# EAGLE design microcontroller-esp32 (EAGLE 9.6.2)
DATE: 22-04-2019; REV: V1 P3; TITLE: TinyPICO
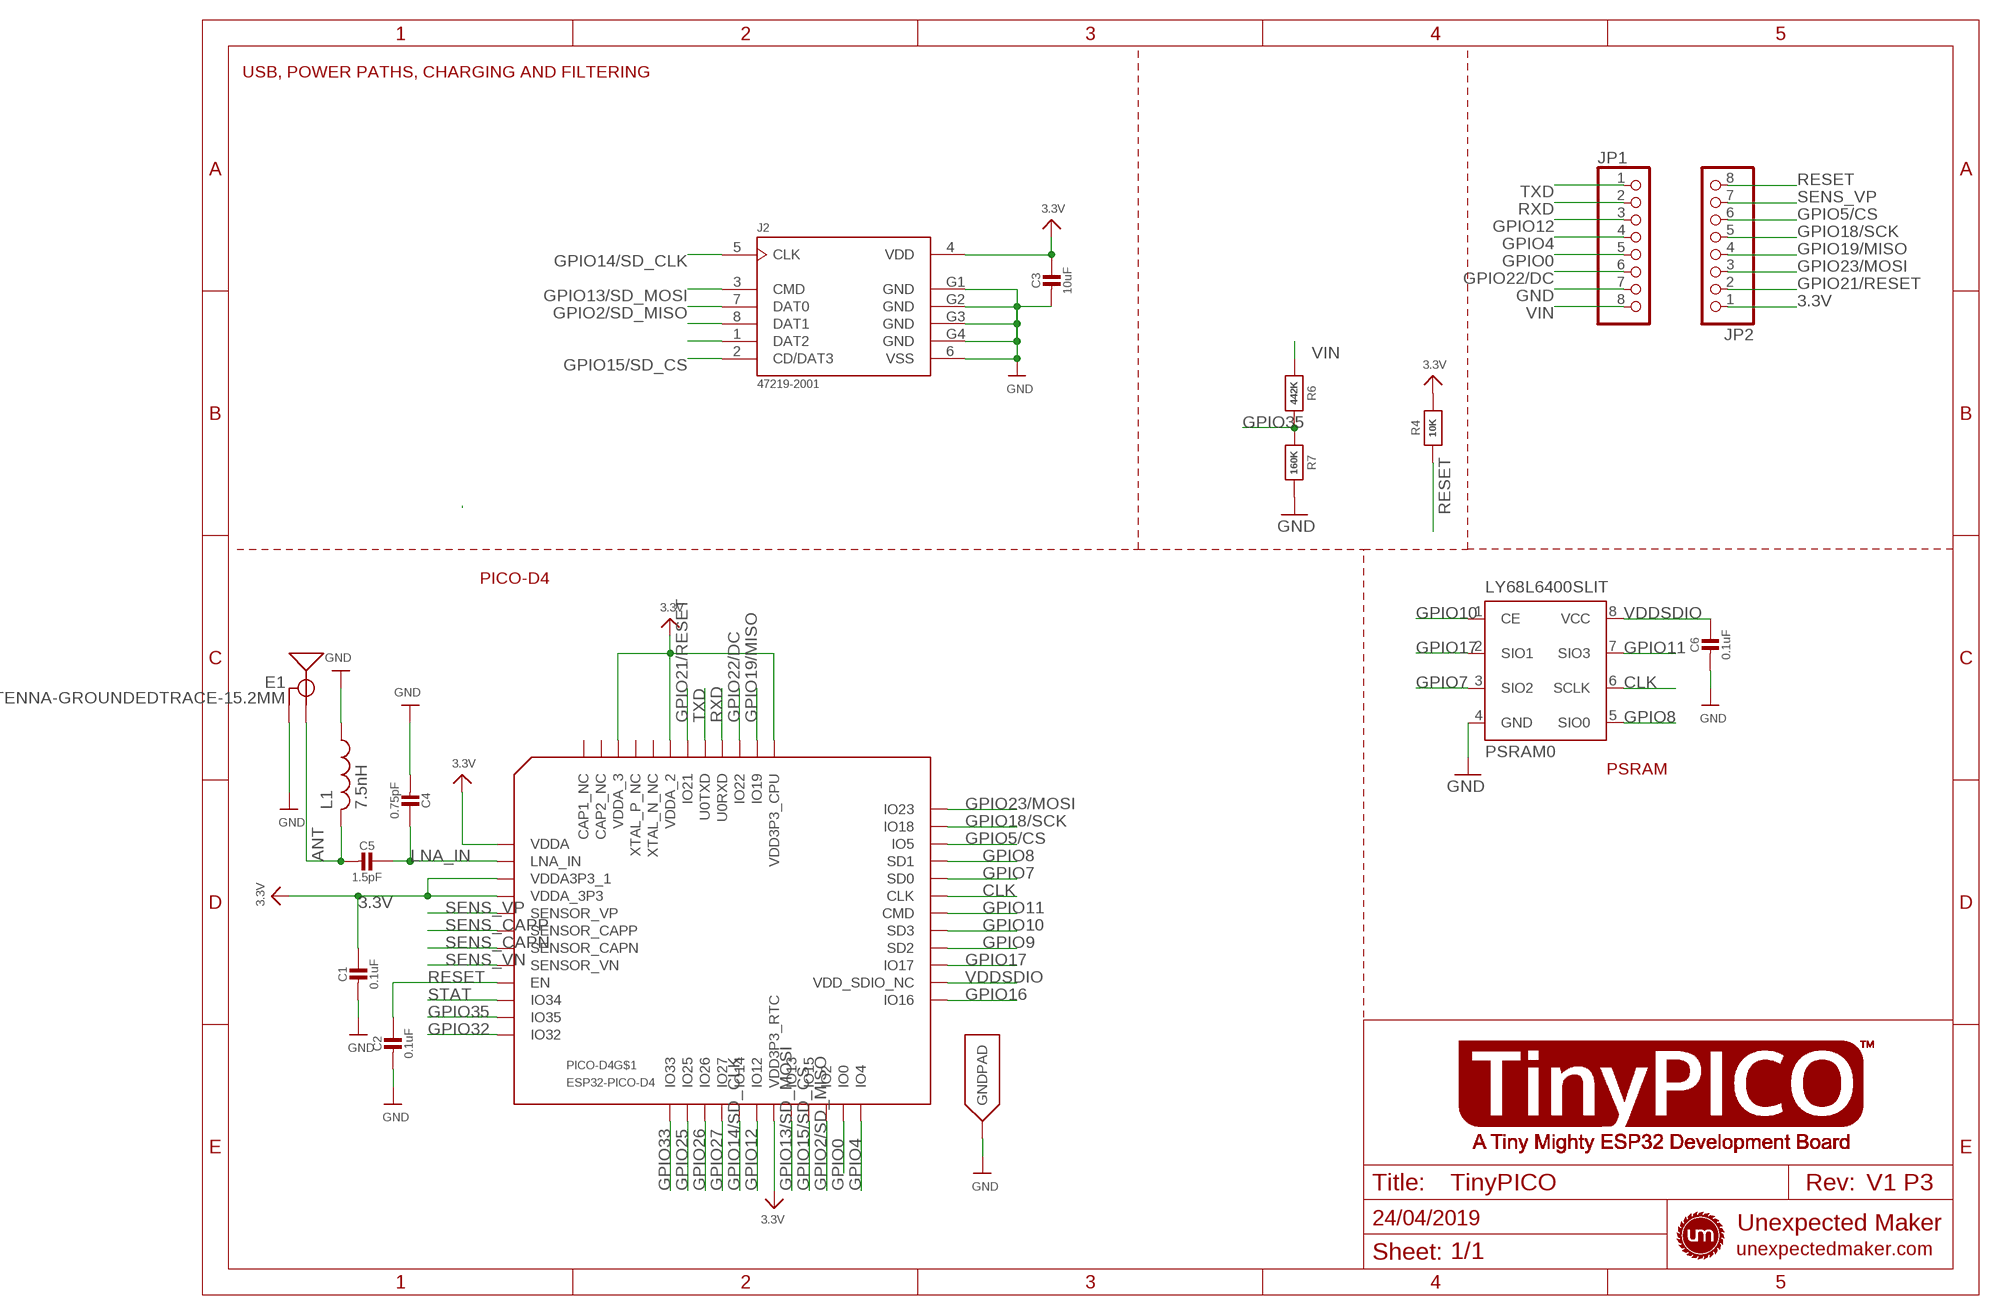
[diagram p0: schematic, sheet 1]
FRAME2 (FRAME_A4_TINYPICO): CDATE: 24/04/2019; REV: V1 P3; SHEET_NUM: 1/1; TITLE: TinyPICO

## Parts
C1  0.1uF  CAP_CERAMIC_0402MP  [_0402MP]
C2  0.1uF  CAP_CERAMIC_0402MP  [_0402MP]
C3  10uF  CAP_CERAMIC_0402MP  [_0402MP]
C4  0.75pF  CAP_CERAMIC_0402MP  [_0402MP]
C5  1.5pF  CAP_CERAMIC_0402MP  [_0402MP]
C6  0.1uF  CAP_CERAMIC_0402MP  [_0402MP]
E1  ANTENNA-GROUNDEDTRACE-15.2MM  [TRACE_ANTENNA_2.4GHZ_15.2MM]
J2  47219-2001  [MOLEX_47219-2001]
JP1  PINHD-1X8CLEANBIG  [1X08-CLEANBIG]
JP2  PINHD-1X8CLEANBIG  [1X08-CLEANBIG]
L1  7.5nH  INDUCTOR_0402_N  [RESC0402_N]
LY68L6400SLIT  PSRAM0  [SOP8]
PICO-D4  ESP32-PICO-D4  [PICO-D4-QFN48]
R4  10K  RESISTOR_0402MP  [_0402MP]
R6  442K  RESISTOR_0402MP  [_0402MP]
R7  160K  RESISTOR_0402MP  [_0402MP]

## Nets
3.3V: C1.1 C3.1 J2.4(VDD) JP2.1 PICO-D4.1(VDDA) PICO-D4.3(VDDA3P3_1) PICO-D4.4(VDDA_3P3) PICO-D4.19(VDD3P3_RTC) PICO-D4.37(VDD3P3_CPU) PICO-D4.43(VDDA_2) PICO-D4.46(VDDA_3) R4.2
ANT: C5.2 E1.ANT(SIGNAL) L1.2
CLK: LY68L6400SLIT.6(SCLK) PICO-D4.31(CLK)
GND: C1.2 C2.2 C3.2 C4.2 C6.2 E1.GND J2.6(VSS) J2.G1(GND) J2.G2(GND) J2.G3(GND) J2.G4(GND) JP1.7 L1.1 LY68L6400SLIT.4(GND) PICO-D4.EXP(GNDPAD) R7.2
GPIO0: JP1.5 PICO-D4.23(IO0)
GPIO2/SD_MISO: J2.7(DAT0) PICO-D4.22(IO2)
GPIO4: JP1.4 PICO-D4.24(IO4)
GPIO5/CS: JP2.6 PICO-D4.34(IO5)
GPIO7: LY68L6400SLIT.3(SIO2) PICO-D4.32(SD0)
GPIO8: LY68L6400SLIT.5(SIO0) PICO-D4.33(SD1)
GPIO9: PICO-D4.28(SD2)
GPIO10: LY68L6400SLIT.1(CE) PICO-D4.29(SD3)
GPIO11: LY68L6400SLIT.7(SIO3) PICO-D4.30(CMD)
GPIO12: JP1.3 PICO-D4.18(IO12)
GPIO13/SD_MOSI: J2.3(CMD) PICO-D4.20(IO13)
GPIO14/SD_CLK: J2.5(CLK) PICO-D4.17(IO14)
GPIO15/SD_CS: J2.2(CD/DAT3) PICO-D4.21(IO15)
GPIO16: PICO-D4.25(IO16)
GPIO17: LY68L6400SLIT.2(SIO1) PICO-D4.27(IO17)
GPIO18/SCK: JP2.5 PICO-D4.35(IO18)
GPIO19/MISO: JP2.4 PICO-D4.38(IO19)
GPIO21/RESET: JP2.2 PICO-D4.42(IO21)
GPIO22/DC: JP1.6 PICO-D4.39(IO22)
GPIO23/MOSI: JP2.3 PICO-D4.36(IO23)
GPIO25: PICO-D4.14(IO25)
GPIO26: PICO-D4.15(IO26)
GPIO27: PICO-D4.16(IO27)
GPIO32: PICO-D4.12(IO32)
GPIO33: PICO-D4.13(IO33)
GPIO35: PICO-D4.11(IO35) R6.2 R7.1
LNA_IN: C4.1 C5.1 PICO-D4.2(LNA_IN)
N$4: J2.8(DAT1)
N$5: J2.1(DAT2)
RESET: C2.1 JP2.8 PICO-D4.9(EN) R4.1
RXD: JP1.2 PICO-D4.40(U0RXD)
SENS_CAPN: PICO-D4.7(SENSOR_CAPN)
SENS_CAPP: PICO-D4.6(SENSOR_CAPP)
SENS_VN: PICO-D4.8(SENSOR_VN)
SENS_VP: JP2.7 PICO-D4.5(SENSOR_VP)
STAT: PICO-D4.10(IO34)
TXD: JP1.1 PICO-D4.41(U0TXD)
VDDSDIO: C6.1 LY68L6400SLIT.8(VCC) PICO-D4.26(VDD_SDIO_NC)
VIN [power]: JP1.8 R6.1
Unconnected: PICO-D4.44(XTAL_N_NC) PICO-D4.45(XTAL_P_NC) PICO-D4.47(CAP2_NC) PICO-D4.48(CAP1_NC)

## Notes on the sheet
- USB, POWER PATHS, CHARGING AND FILTERING
- PICO-D4
- PSRAM

## Library data of the parts
C1-C6 = microbuilder:CAP_CERAMIC: Ceramic Capacitors For new designs, use the packages preceded by an '_' character since they are more reliable: The following footprints should be used on most boards: _0402 - Standard footprint for regular board layouts _0603 - Standard footprint for regular board layouts _0805 - Standard footprint for regular board layouts _1206 - Standard footprint for regular board layouts For extremely tight-pitch boards where space is at a premium, the following 'micro-pitch' footprints can be used (smaller pads, no silkscreen outline, etc.): _0402MP - Micro-pitch footprint for very dense/compact boards _0603MP - Micro-pitch footprint for very dense/compact boards _0805MP - Micro-pitch footprint for very dense/compact boards _1206MP - Micro-pitch footprint for very dense/compact boards
E1 = SparkFun-RF:ANTENNA-GROUNDED: Antenna w/ Ground Connection 2.4GHz antennae with signal and ground terminals. TRACE_ANTENNA_2.4GHZ_15.2MM - Meander Trace antenna 15.2 x 5.7mm footprint Based on layout from TI app note AN043 <http://www.ti.com/lit/an/swra117d/swra117d.pdf>. TRACE_ANTENNA_2.4GHZ_25.7MM - Inverted F trace antenna 25.7 x 7.5 mm footprint. Based on layout from TI design note DN0007 <http://www.ti.com/lit/an/swru120b/swru120b.pdf>.
J2 = 47219-2001:47219-2001: 1.10mm Pitch microSD Card Connector, Hinge Type, Lead-Free http://www.snapeda.com/parts/47219-2001/Molex%20/%20Waldom/view-part/# Check prices <https://pricing.snapeda.com/parts/47219-2001/Molex/view-part?ref=eda>; AVAILABILITY: In Stock; DESCRIPTION: 8 Position Card Connector Secure Digital - microSD™ Surface Mount, Right Angle Gold; MF: Molex; MP: 47219-2001; PACKAGE: None; PRICE: None; PURCHASE-URL: https://pricing.snapeda.com/search/part/47219-2001/?ref=eda
JP1 JP2 = adafruit:PINHD-1X8: PIN HEADER; BOTTOM: 1; MPN: 83-15410; THRU-HOLE: 1
L1 = Nordic_nRF:INDUCTOR: Generic chip inductor
LY68L6400SLIT = UnexpectedMaker:PSRAM: H-bridge driver for brush motors Source: http://www.rohm.com/products/databook/motor/pdf/bd623x_series-e.pdf; MPN: BD6230F-E2; OC_FARNELL: 1716264; OC_NEWARK: 15R0529
PICO-D4 = UnexpectedMaker:ESP32-PICO-D4
R4 R6 R7 = microbuilder:RESISTOR: Resistors 0402 - 0402 Surface Mount Package 22 Ohm 1% 1/16W [Digikey: 311-22.0LRTR-ND] 33 Ohm 5% 1/16W 1.0K 5% 1/16W 1.5K 5% 1/16W 2.0K 1% 1/16W 10.0K 1% 1/16W [Digikey: 311-10.0KLRTR-ND] 10.0K 5% 1/16W [Digikey: RMCF0402JT10K0TR-ND] 12.1K 1% 1/16W [Digikey: 311-22.0LRTR-ND] 100.0K 5% 1/16W 0603 - 0603 Surface Mount Package 0 Ohm 1/10 Watt 1% Resistor 15 Ohm 1/10 Watt 1% Resistor 33 Ohm 1/10 Watt 1% Resistor 49.9 Ohm 1/10 Watt 1% Resistor 100 Ohm 1/10 Watt 1% Resistor 150 Ohm 1/10 Watt 1% Resistor 240 Ohm 1/10 Watt 1% Resistor 390 Ohm 1/10 Watt 1% Resistor 560 Ohm 1/10 Watt 1% Resistor 680 Ohm 1/10 Watt 1% Resistor 750 Ohm 1/10 Watt 1% Resistor 1.0K Ohm 1/10 Watt 1% Resistor 1.5K Ohm 1/10 Watt 1% Resistor 2.0K Ohm 1/10 Watt 1% Resistor 2.2K Ohm 1/10 Watt 1% Resistor 3.3K Ohm 1/10 Watt 1% Resistor 4.7K Ohm 1/10 Watt 1% Resistor 10.0K Ohm 1/10 Watt 1% Resistor 12.0K Ohm 1/10 Watt 1% Resistor 12.1K Ohm 1/10 Watt 1% Resistor 20.0K Ohm 1/10 Watt 1% Resistor 33.0K Ohm 1/10 Watt 1% Resistor 100.0K Ohm 1/10 Watt 1% Resistor 0805 - 0805 Surface Mount Package 0 Ohm 1/8 Watt 1% Resistor 33 Ohm 1/8 Watt 1% Resistor 100 Ohm 1/8 Watt 1% Resistor 150 Ohm 1/8 Watt 1% Resistor 200 Ohm 1/8 Watt 1% Resistor 240 Ohm 1/8 Watt 1% Resistor 330 Ohm 1/8 Watt 1% Resistor 390 Ohm 1/8 Watt 1% Resistor 470 Ohm 1/8 Watt 1% Resistor 1.0K Ohm 1/8 Watt 1% Resistor 1.5K Ohm 1/8 Watt 1% Resistor 2.0K Ohm 1/8 Watt 1% Resistor 4.7K Ohm 1/8 Watt 1% Resistor 5.1K Ohm 1/8 Watt 1% Resistor 5.6K Ohm 1/8 Watt 1% Resistor 10.0K Ohm 1/8 Watt 1% Resistor 22.0K Ohm 1/8 Watt 1% Resistor 33.0K Ohm 1/8 Watt 1% Resistor 100K Ohm 1/8 Watt 1% Resistor 1206 - 1206 Surface Mount Package 2012 - 2010 Surface Mount Package 0.11 Ohm 1/2 Watt 1% Resistor - Digikey: RHM.11UCT-ND

## Net classes
1 power: width 0.406 mm

## Board
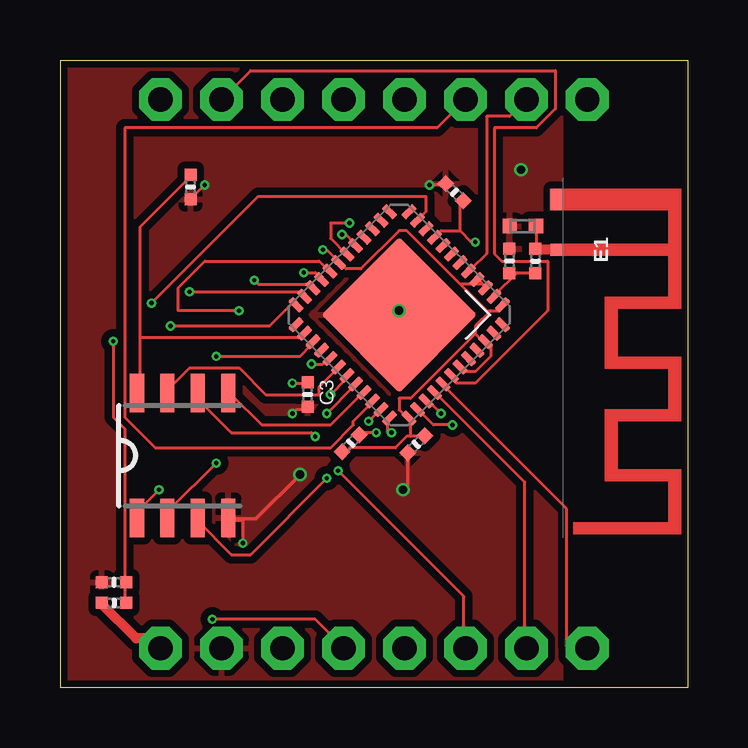
[diagram p1: board, top side]
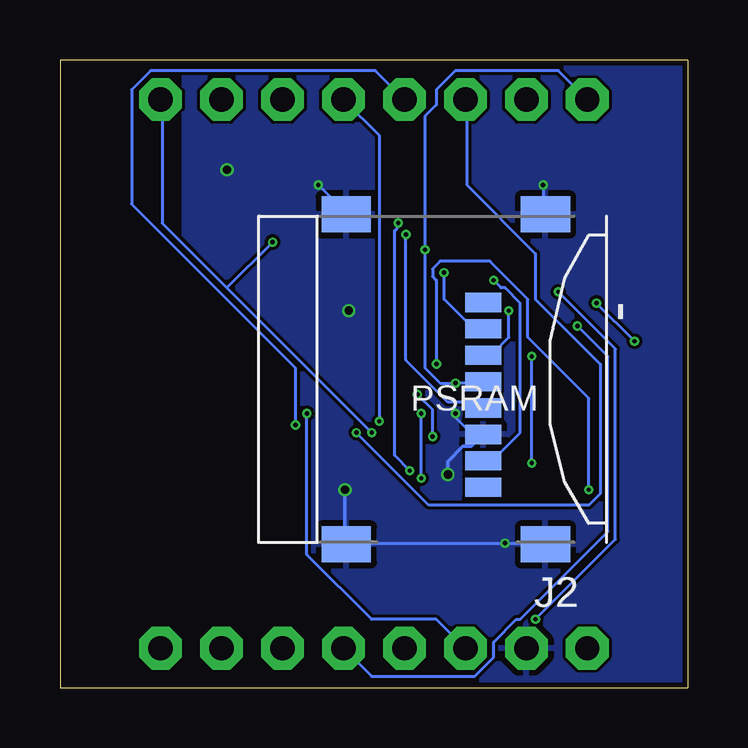
[diagram p2: board, bottom side, seen from below]

Size 26.16 x 26.16 mm. Coordinates in mm from the lower left corner, seen from the top.
Outline: 26.16,0 0,0 0,26.16 26.16,26.16 26.16,0
Copper layers (1+2*15+16): Top 0.035mm / dielectric 0.18mm / GND 0.017mm / dielectric 1.12mm / 3.3V 0.017mm / dielectric 0.18mm / Bottom 0.035mm
Design rules "UnexpectedMaker_JLCPCB 4 Layer Tight": minimum track width 5mil, minimum drill 7mil, track to track 5mil, track to pad 5mil, pad to pad 5mil, via to via 5mil, smd to smd 5mil, copper to edge 9mil, drill to drill 6mil, minimum pad ring 4mil, minimum via ring 4mil, stop-mask expansion 1.25mil, vias tented up to drill 12mil, thermal gap 10mil

### Footprints (pad centres in the part's own frame; a part is rotated, then mirrored left to right if it is on the bottom)
_0402MP = smd 0.5 x 0.5: 1 -0.508,0; 2 0.508,0
TRACE_ANTENNA_2.4GHZ_15.2MM = smd 0.5 x 0.5: ANT 0,-0.25 | smd 0.9 x 0.5: GND -2.1,-0.25
MOLEX_47219-2001 = smd 0.8 x 1.5: 1 3.2,-2.1; 2 2.1,-2.1; 3 1,-2.1; 4 -0.1,-2.1; 5 -1.2,-2.1; 6 -2.3,-2.1; 7 -3.4,-2.1; 8 -4.5,-2.1 | smd 1.5 x 2.05: G1 6.875,-4.7; G2 6.875,3.6; G3 -6.875,3.6; G4 -6.875,-4.7
1X08-CLEANBIG = drill 1.016 pad 1.778 octagon: 1 -8.89,0; 2 -6.35,0; 3 -3.81,0; 4 -1.27,0; 5 1.27,0; 6 3.81,0; 7 6.35,0; 8 8.89,0
RESC0402_N = smd 0.6 x 0.6: 1 -0.55,0; 2 0.55,0
SOP8 = smd 0.6 x 1.6: 1 -1.905,-2.6; 2 -0.635,-2.6; 3 0.635,-2.6; 4 1.905,-2.6; 5 1.905,2.6; 6 0.635,2.6; 7 -0.635,2.6; 8 -1.905,2.6
PICO-D4-QFN48 = smd 0.66 x 0.3: 1 -3.327,2.75; 2 -3.327,2.25; 3 -3.327,1.75; 4 -3.327,1.25; 5 -3.327,0.75; 6 -3.327,0.25; 7 -3.327,-0.25; 8 -3.327,-0.75; 9 -3.327,-1.25; 10 -3.327,-1.75; 11 -3.327,-2.25; 12 -3.327,-2.75; 25 3.327,-2.75; 26 3.327,-2.25; 27 3.327,-1.75; 28 3.327,-1.25; 29 3.327,-0.75; 30 3.327,-0.25; 31 3.327,0.25; 32 3.327,0.75; 33 3.327,1.25; 34 3.327,1.75; 35 3.327,2.25; 36 3.327,2.75 | smd 0.3 x 0.66: 13 -2.75,-3.327; 14 -2.25,-3.327; 15 -1.75,-3.327; 16 -1.25,-3.327; 17 -0.75,-3.327; 18 -0.25,-3.327; 19 0.25,-3.327; 20 0.75,-3.327; 21 1.25,-3.327; 22 1.75,-3.327; 23 2.25,-3.327; 24 2.75,-3.327; 37 2.75,3.327; 38 2.25,3.327; 39 1.75,3.327; 40 1.25,3.327; 41 0.75,3.327; 42 0.25,3.327; 43 -0.25,3.327; 44 -0.75,3.327; 45 -1.25,3.327; 46 -1.75,3.327; 47 -2.25,3.327; 48 -2.75,3.327 | smd 4.572 x 4.572: EXP 0,0

### Placement (x,y rotation side)
C1  14.85,10.15 225 top
C2  16.44,20.66 135 top
C3  10.32,12.22 270 top
C4  18.73,17.79 90 top
C5  19.81,17.79 90 top
C6  5.44,20.87 270 top
E1  20.95,18.26 270 top
J2  10.64,12.86 90 bottom
JP1  13.08,1.65 180 top
JP2  13.08,24.51 0 top
L1  19.29,19.24 0 top
LY68L6400SLIT  5.11,9.68 0 top
PICO-D4  14.14,15.54 225 top
R4  12.11,10.19 225 top
R6  2.25,3.54 0 top
R7  2.25,4.4 180 top

### Tracks (layer width: path | path; a pad name or v marks a point on that pad's centre or on a via)
3.3V  (via drill 0.18)
  Top 0.127: 14.61,10.48 15.08,10.48 C1.1 | 14.61,10.48 14.45,10.48 13.97,10 12.06,10 11.91,9.84 R4.2 | 14.61,10.48 14.61,11.11 PICO-D4.37 14.45,11.27 14.13,11.59 14.13,12.06 14.61,12.06 17.3,14.76 | PICO-D4.43 16.67,13.34 16.83,13.18 17.3,13.18 17.94,13.81 17.94,14.29 17.78,14.29 PICO-D4.46 17.62,14.45 17.3,14.76 | 17.62,16.83 17.78,16.67 PICO-D4.3 | 17.62,16.83 17.46,16.99 PICO-D4.4 | 16.67,16.83 14.45,19.05 14.13,19.05 12.54,17.46 11.91,17.46 11.75,17.62 PICO-D4.19 11.59,17.78 11.11,18.26 v10.95,18.26 | 17.62,16.83 16.67,16.83 | 17.94,15.72 17.78,15.72 16.67,16.83 | 17.94,15.72 18.26,15.72 18.41,15.88 PICO-D4.1 | 17.3,14.76 17.3,15.08 17.94,15.72 | v9.68,12.7 10.32,12.7 C3.1
  Bottom 0.127: J2.4 8.57,12.7 v9.68,12.7 10.32,12.7 10.95,13.34 v10.95,18.26 10.95,23.81 10.48,24.29 10.48,24.92 9.68,25.72 5.4,25.72 JP2.1
ANT
  Top 0.127: C5.2 19.84,18.41 19.84,19.21 L1.2
  Top 0.406: E1.ANT 19.85,18.26 C5.2
CLK  (via drill 0.18)
  Top 0.127: v11.27,12.22 11.91,12.86 PICO-D4.31 | v10.64,10.48 10.48,10.64 7.14,10.64 5.87,11.91 5.87,12.22 LY68L6400SLIT.6
  Bottom 0.127: v11.27,12.22 10.64,11.59 v10.64,10.48
GND  (via drill 0.18, 0.35)
  Top 0.127: v9.68,11.43 9.84,11.59 10.32,11.59 C3.2 | 18.73,18.41 C4.2 | v6.03,20.95 5.56,20.48 C6.2 | v15.4,20.95 16.03,20.95 C2.2 | v7.62,6.03 7.62,6.99 7.14,6.99 7.07,7.04 LY68L6400SLIT.4
  Top 0.152: C1.2 14.49,8.46 v14.29,8.26 | v10,8.89 8.15,7.04 7.07,7.04
  Bottom 0.127: J2.G4 6.03,6.03 v7.62,6.03 14.13,6.03 J2.G3 | v9.68,11.43 9.68,11.27 9.05,10.64 8.57,10.64 J2.6 | v6.03,20.95 6.03,19.84 J2.G1 | v15.4,20.95 14.29,19.84 J2.G2
  Bottom 0.152: v14.29,8.26 14.29,6.04 J2.G3 | J2.6 9.03,10.06 9.37,10.06 10,9.43 v10,8.89
  other vias: 14.13,15.72 19.21,21.59
  pour Bottom: -0.32,26.51 -0.32,-0.48 20.95,-0.48 20.95,26.51
  pour Top (isolate 0.305): -0.36,26.34 -0.36,-0.49 20.9,-0.49 20.9,26.34
GPIO0  (via drill 0.18)
  Top 0.127: v5.4,16.51 10,16.51 10.16,16.35 PICO-D4.23 | v6.35,2.86 10.64,2.86 11.75,1.75 JP1.5
  Bottom 0.127: v5.4,16.51 3.02,14.13 3.02,6.19 v6.35,2.86
GPIO2/SD_MISO  (via drill 0.18)
  Top 0.127: v8.1,16.99 8.26,16.83 10.32,16.83 10.48,16.67 PICO-D4.22
  Bottom 0.127: v8.1,16.99 7.78,16.67 7.62,16.67 6.99,16.03 6.99,10.64 8.1,9.53 8.41,9.53 J2.7
GPIO4  (via drill 0.18)
  Top 0.127: v4.6,15.08 8.73,15.08 9.68,16.03 PICO-D4.24
  Bottom 0.127: v4.6,15.08 3.33,13.81 3.33,6.51 6.99,2.86 7.14,2.86 8.1,1.91 8.1,1.27 8.89,0.48 13.18,0.48 JP1.4
GPIO5/CS
  Top 0.127: JP2.6 15.72,23.34 2.7,23.34 2.7,11.27 3.97,10 11.27,10 12.22,10.95 12.22,11.11 13.02,11.91 PICO-D4.34
GPIO7  (via drill 0.18)
  Top 0.127: v11.11,11.43 12.22,12.54 PICO-D4.32 | v11.11,8.73 7.94,5.56 7.14,5.56 5.71,6.99 LY68L6400SLIT.3
  Bottom 0.127: v11.11,8.73 v11.11,11.43
GPIO8
  Top 0.127: PICO-D4.33 12.54,12.22 11.27,10.95 8.41,10.95 7.14,12.22 LY68L6400SLIT.5
GPIO10  (via drill 0.18)
  Top 0.127: v10.48,13.49 10.95,13.49 11.11,13.65 PICO-D4.29 | v4.13,8.26 3.33,7.46 3.33,7.14 LY68L6400SLIT.1
  Bottom 0.127: v10.48,13.49 10.48,16.99 10.64,17.14 10.64,17.46 10.32,17.78 8.26,17.78 6.67,16.19 6.67,14.61 4.13,12.06 v4.13,8.26
GPIO11
  Top 0.127: PICO-D4.30 11.59,13.34 10.79,12.54 10.79,12.22 8.57,12.22 7.46,13.34 5.4,13.34 4.45,12.38 LY68L6400SLIT.7
GPIO12  (via drill 0.18)
  Top 0.127: v12.06,19.37 11.27,19.37 11.27,18.73 11.91,18.1 PICO-D4.18 | v11.59,9.05 16.83,3.81 16.83,1.75 JP1.3
  Bottom 0.127: v12.06,19.37 12.06,19.21 12.22,19.05 12.22,9.68 v11.59,9.05
GPIO13/SD_MOSI  (via drill 0.18)
  Top 0.127: v7.46,15.72 4.92,15.72 4.92,16.67 6.03,17.78 10.79,17.78 11.11,17.46 PICO-D4.20
  Bottom 0.127: v7.46,15.72 7.46,14.61 8.1,13.97 8.41,13.97 J2.3
GPIO14/SD_CLK  (via drill 0.18)
  Top 0.127: v11.75,18.89 11.91,18.89 12.22,18.57 PICO-D4.17
  Bottom 0.127: v11.75,18.89 11.75,13.65 10,11.91 8.73,11.91 8.57,11.75 J2.5
GPIO15/SD_CS  (via drill 0.18)
  Top 0.127: v10.16,17.3 10.64,17.3 10.79,17.14 PICO-D4.21
  Bottom 0.127: v10.16,17.3 10.16,16.19 9.05,15.08 8.57,15.08 J2.2
GPIO17  (via drill 0.18)
  Top 0.127: v6.51,13.81 10,13.81 10.48,14.29 PICO-D4.27 | v6.51,9.37 4.6,7.46 4.6,7.14 LY68L6400SLIT.2
  Bottom 0.127: v6.51,9.37 v6.51,13.81
GPIO18/SCK  (via drill 0.18)
  Top 0.127: v12.86,11.11 13.34,11.59 PICO-D4.35
  Bottom 0.127: v12.86,11.11 12.86,23.02 JP2.5
GPIO19/MISO  (via drill 0.18)
  Top 0.127: v16.35,10.95 15.56,10.95 14.92,11.59 PICO-D4.38
  Bottom 0.127: v16.35,10.95 16.35,13.34 23.18,20.16 23.18,24.92 22.38,25.72 13.02,25.72 JP2.4
GPIO21/RESET
  Top 0.127: JP2.2 7.94,25.72 20.64,25.72 20.64,24.13 19.84,23.34 18.1,23.34 18.1,18.1 18.41,17.78 20.32,17.78 20.32,15.72 17.3,12.7 16.51,12.7 16.35,12.86 PICO-D4.42
GPIO22/DC  (via drill 0.18)
  Top 0.127: v15.88,11.43 15.4,11.91 PICO-D4.39
  Bottom 0.127: v15.88,11.43 15.88,5.56 13.18,2.86 10.48,2.86 JP1.6
GPIO23/MOSI  (via drill 0.18)
  Top 0.127: v13.81,10.64 13.65,10.64 13.65,11.11 PICO-D4.36
  Bottom 0.127: v13.81,10.64 10.79,7.62 4.13,7.62 3.65,8.1 3.65,13.49 6.35,16.19 6.35,18.1 9.21,20.95 9.21,24.45 JP2.3
GPIO35  (via drill 0.18)
  Top 0.127: v3.81,16.03 8.26,20.48 15.24,20.48 15.24,19.84 14.92,19.53 PICO-D4.11 | R6.2 2.7,3.65 2.7,4.29 R7.1 2.7,4.45 2.7,10.79 2.22,11.27 v2.22,14.45
  Bottom 0.127: v2.22,14.45 v3.81,16.03
LNA_IN
  Top 0.127: 19.05,17.3 18.73,17.3 C4.1 | 19.05,17.3 19.68,17.3 C5.1 | 19.05,17.3 18.1,16.35 PICO-D4.2
RESET  (via drill 0.18)
  Top 0.127: 16.67,19.05 16.67,20.16 C2.1 | 16.67,19.05 15.88,19.05 15.72,18.89 PICO-D4.9 | v13.18,10.64 12.54,10.64 R4.1 | 16.67,19.05 17.14,18.57 v17.3,18.57
  Bottom 0.127: 19.21,16.67 21.91,19.37 21.91,24.45 JP2.8 | 19.21,16.67 v13.18,10.64 | 19.21,16.67 v17.3,18.57
RXD
  Top 0.127: PICO-D4.40 15.72,12.22 19.37,8.57 19.37,1.75 JP1.2
SENS_VP
  Top 0.127: JP2.7 18.73,23.81 17.78,23.81 17.78,18.1 17.14,17.46 PICO-D4.5
TXD
  Top 0.127: PICO-D4.41 16.03,12.54 21.11,7.46 21.11,1.75 21.91,1.75 JP1.1
VDDSDIO
  Top 0.127: 3.33,14.61 3.33,12.38 LY68L6400SLIT.8 | 3.33,14.61 3.33,19.21 5.4,21.27 C6.1 | 3.33,14.61 10,14.61 10.16,14.76 PICO-D4.26
VIN
  Top 0.406: 4.29,2.06 4.29,1.75 JP1.8 4.13,2.06 3.17,2.06 1.75,3.49 R6.1

### Text on the board
bPlace: - | PSRAM